# EAGLE schematic simple-bob-adapter (EAGLE 9.0.1)
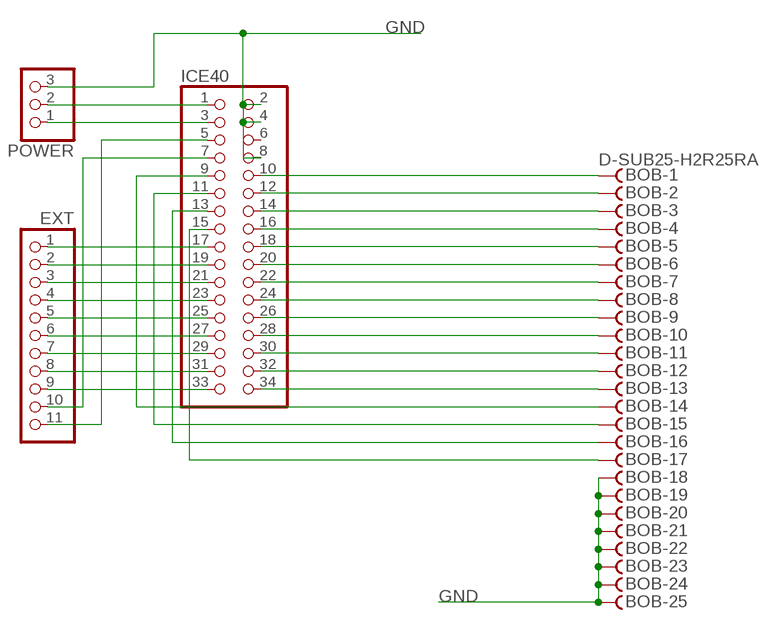
[diagram p0: schematic, sheet 1]

## Parts
BOB  D-SUB25-H2R25RA  [H2R25RA]
EXT  PINHD-1X11  [1X11]
ICE40  PINHD-2X17/90  [2X17/90]
POWER  PINHD-1X3  [1X03]

## Nets
GND: BOB.18 BOB.19 BOB.20 BOB.21 BOB.22 BOB.23 BOB.24 BOB.25 ICE40.2 ICE40.4 ICE40.8 POWER.3
N$1: BOB.1 ICE40.10
N$2: BOB.2 ICE40.12
N$3: BOB.3 ICE40.14
N$4: BOB.4 ICE40.16
N$5: BOB.5 ICE40.18
N$6: BOB.6 ICE40.20
N$7: BOB.7 ICE40.22
N$8: BOB.8 ICE40.24
N$9: BOB.9 ICE40.26
N$10: BOB.10 ICE40.28
N$11: BOB.11 ICE40.30
N$12: BOB.12 ICE40.32
N$13: BOB.13 ICE40.34
N$14: BOB.15 ICE40.11
N$15: ICE40.3 POWER.1
N$16: BOB.16 ICE40.13
N$17: BOB.17 ICE40.15
N$18: EXT.1 ICE40.17
N$19: EXT.2 ICE40.19
N$20: EXT.3 ICE40.21
N$21: EXT.4 ICE40.23
N$22: EXT.5 ICE40.25
N$23: EXT.6 ICE40.27
N$24: EXT.7 ICE40.29
N$25: EXT.8 ICE40.31
N$26: EXT.9 ICE40.33
N$27: BOB.14 ICE40.9
N$28: ICE40.1 POWER.2
N$29: EXT.10 ICE40.7
N$30: EXT.11 ICE40.5
Unconnected: ICE40.6

## Library data of the parts
BOB = con-thomas-betts:D-SUB25-: D-Subminiatur Connector Source: Electronioc Interconnects European Edition 1998; OC_FARNELL: unknown; OC_NEWARK: unknown
EXT = pinhead:PINHD-1X11: PIN HEADER
ICE40 = pinhead:PINHD-2X17: PIN HEADER
POWER = pinhead:PINHD-1X3: PIN HEADER